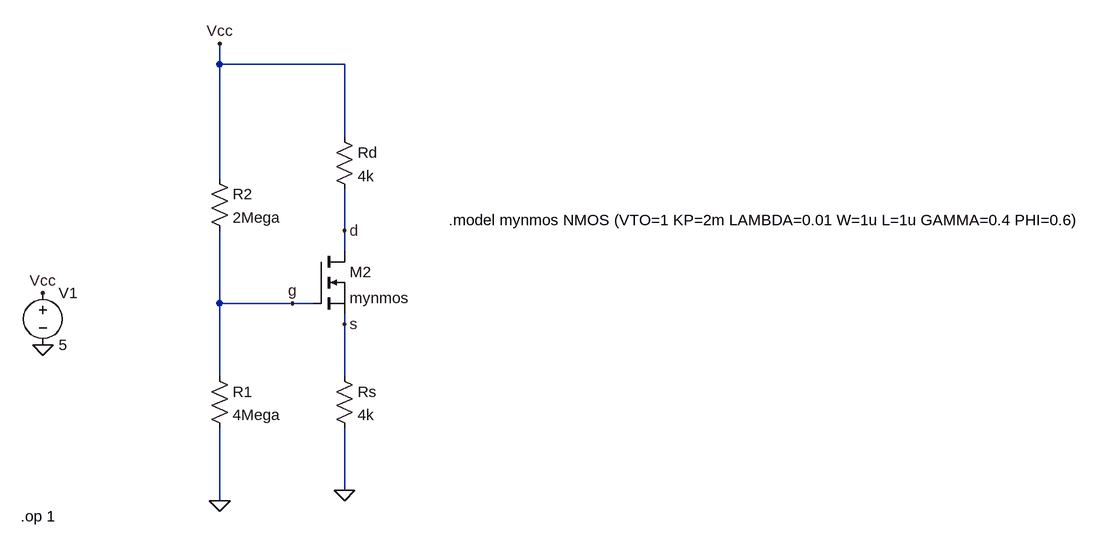
[diagram p0: schematic Draft64.asc]
Draft64.asc, the LTspice schematic file:
Version 4
SHEET 1 1560 680
WIRE 48 -224 48 -256
WIRE 240 -224 48 -224
WIRE 240 -112 240 -224
WIRE 48 -48 48 -224
WIRE 240 32 240 -32
WIRE 240 64 240 32
WIRE 48 144 48 32
WIRE 160 144 48 144
WIRE 192 144 160 144
WIRE 240 176 240 160
WIRE 48 256 48 144
WIRE 240 256 240 176
WIRE 240 432 240 336
WIRE 48 448 48 336
FLAG 240 432 0
FLAG 48 448 0
FLAG -224 208 0
FLAG 48 -256 Vcc
FLAG -224 128 Vcc
FLAG 160 144 g
FLAG 240 32 d
FLAG 240 176 s
SYMBOL res 224 240 R0
SYMATTR InstName Rs
SYMATTR Value 4k
SYMBOL res 32 240 R0
SYMATTR InstName R1
SYMATTR Value 4Mega
SYMBOL res 32 -64 R0
SYMATTR InstName R2
SYMATTR Value 2Mega
SYMBOL res 224 -128 R0
SYMATTR InstName Rd
SYMATTR Value 4k
SYMBOL voltage -224 112 R0
WINDOW 123 0 0 Left 0
WINDOW 39 0 0 Left 0
SYMATTR InstName V1
SYMATTR Value 5
SYMBOL nmos 192 64 R0
SYMATTR InstName M2
SYMATTR Value mynmos
TEXT 400 16 Left 2 !.model mynmos NMOS (VTO=1 KP=2m LAMBDA=0.01 W=1u L=1u GAMMA=0.4 PHI=0.6)
TEXT -258 472 Left 2 !.op 1

The netlist it stands for:
* Draft64.asc
Rs s 0 4k
R1 g 0 4Mega
R2 Vcc g 2Mega
Rd Vcc d 4k
V1 Vcc 0 5
M2 d g s s mynmos
.model NMOS NMOS
.model PMOS PMOS
.lib standard.mos
.model mynmos NMOS (VTO=1 KP=2m LAMBDA=0.01 W=1u L=1u GAMMA=0.4 PHI=0.6)
.op 1
.backanno
.end